# Altium schematic sheet STM32F4_OSD_V13.SchDoc
size 292 x 228 mm
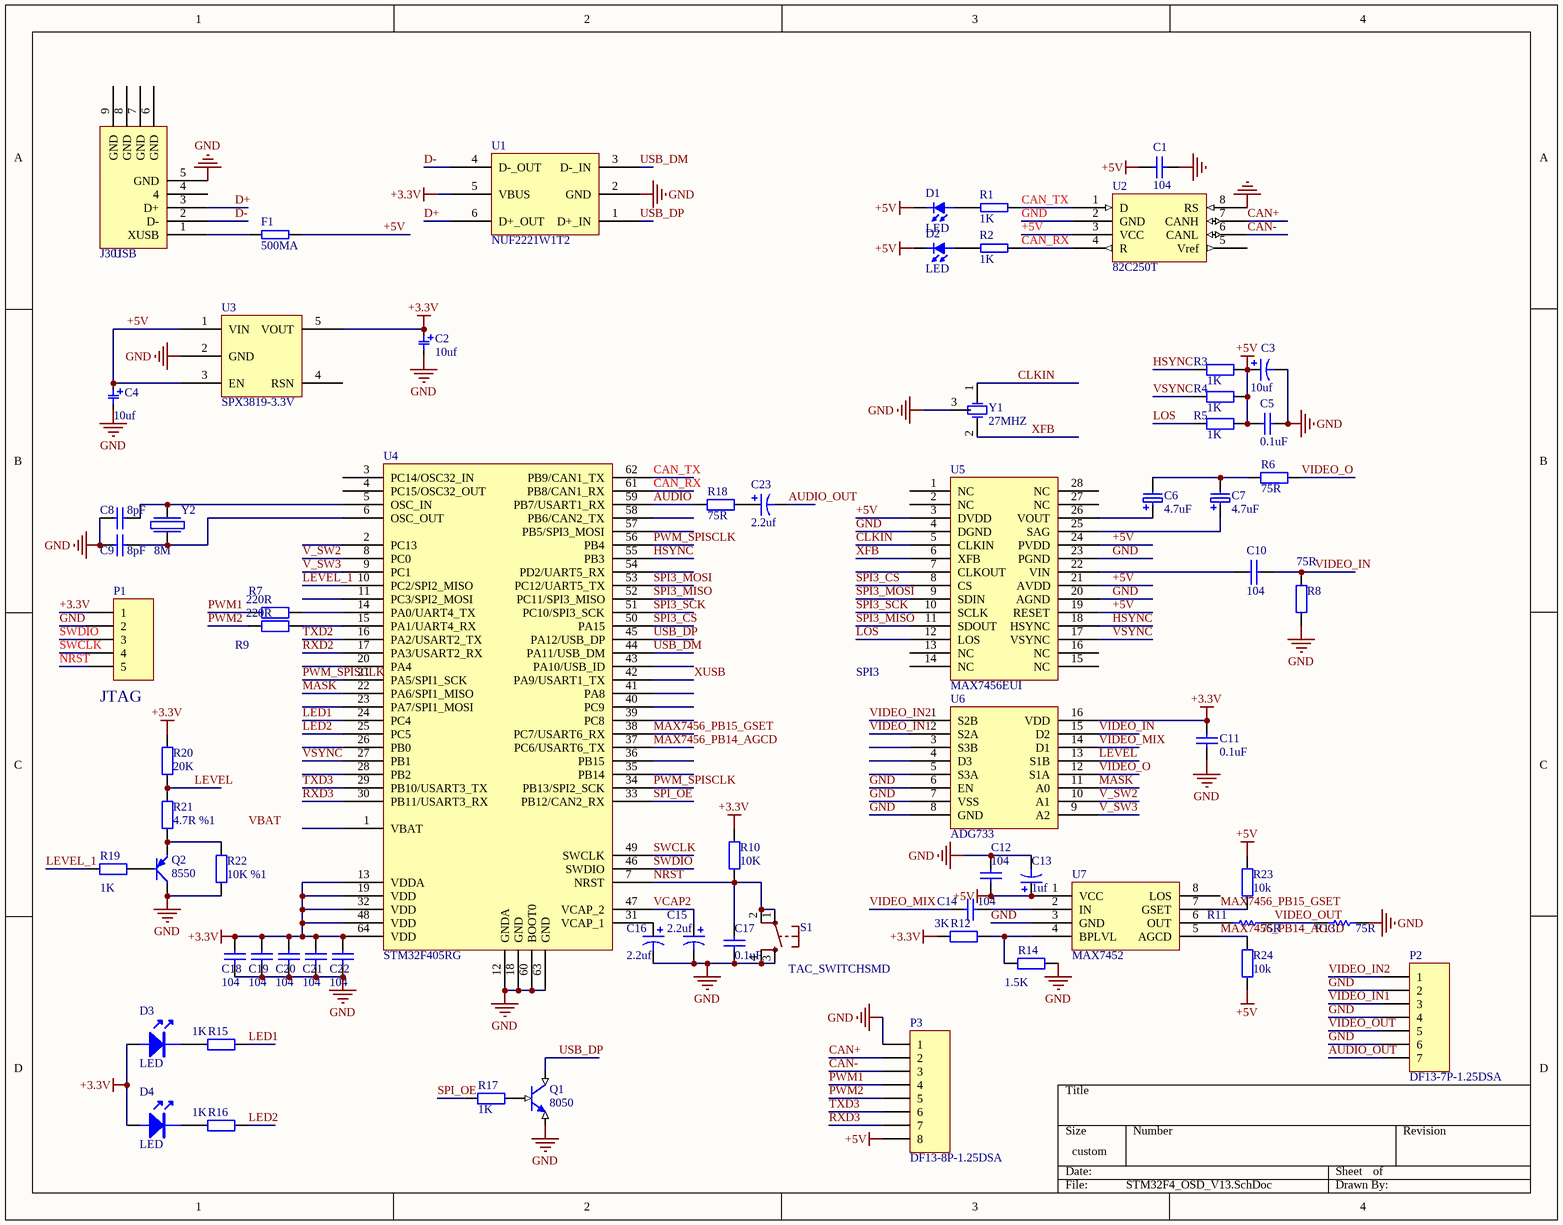
[diagram p0: STM32F4_OSD_V13.SchDoc]

## Parts
C1  104  [0603C]
C2  10uf  [0805]
C3  10uf  [0603C]
C4  10uf  [0805]
C5  value 0.1uF  [0402-CAP]  (hidden comment: Cap)
C6  4.7uF  [0603C]
C7  4.7uF  [0603C]
C8  8pF  [0402-CAP]
C9  8pF  [0402-CAP]
C10  104  [0402-CAP]
C11  value 0.1uF  [0402-CAP]  (hidden comment: Cap)
C12  104  [0402-CAP]
C13  1uf  [0603C]
C14  104  [0402-CAP]
C15  2.2uf  [0603C]
C16  2.2uf  [0603C]
C17  value 0.1uF  [0402-CAP]  (hidden comment: Cap)
C18  104  [0402-CAP]
C19  104  [0402-CAP]
C20  104  [0402-CAP]
C21  104  [0402-CAP]
C22  104  [0402-CAP]
C23  2.2uf  [0603C]
D1  LED  [0603-LED]
D2  LED  [0603-LED]
D3  LED  [0603-LED]
D4  LED  [0603-LED]
F1  500MA  [PTC-1206]
J301  USB  [MOLEX_MICRO_USB_AB_BOTTOM_MOUNT]
P1  JTAG  [DF13-5P-1.25DSA]
P2  DF13-7P-1.25DSA  [DF13C-7P-1.25V]
P3  DF13-8P-1.25DSA  [DF13C-8P-1.25V]
Q1  8050  [SOT-23]
Q2  8550  [PNP8550]
R1  1K  [0402-RES]
R2  1K  [0402-RES]
R3  1K  [0402-RES]
R4  1K  [0402-RES]
R5  1K  [0402-RES]
R6  75R  [0402-RES]
R7  220R  [0402-RES]
R8  75R  [0402-RES]
R9  220R  [0402-RES]
R10  10K  [0402-RES]
R11  75R  [0402-RES]
R12  3K  [0402-RES]
R13  75R  [0402-RES]
R14  1.5K  [0402-RES]
R15  1K  [0402-RES]
R16  1K  [0402-RES]
R17  1K  [0402-RES]
R18  75R  [0402-RES]
R19  1K  [0402-RES]
R20  20K  [0402-RES]
R21  4.7R %1  [0402-RES]
R22  10K %1  [0402-RES]
R23  10k  [0402-RES]
R24  10k  [0402-RES]
S1  TAC_SWITCHSMD  [EVQP7J01K]
U1  NUF2221W1T2  [SOT363]
U2  82C250T  [SO-8N]
U3  SPX3819-3.3V  [SOT23-5]
U4  STM32F405RG  [LQFP64]
U5  MAX7456EUI  [SSOP-28]
U6  ADG733  [TSOP16]
U7  MAX7452  [SOIC-SN8_N]
Y1  27MHZ  [27MHZ]
Y2  8M  [OSCILLATOR-3.2X2.5]

## Nets
+3.3V: C2.2 C11.2 C18.2 C19.2 C20.2 C21.2 C22.2 D3.1 D4.1 P1.1 R10.2 R12.2 R20.1 U1.5(VBUS) U3.5(VOUT) U4.13(VDDA) U4.19(VDD) U4.32(VDD) U4.48(VDD) U4.64(VDD) U6.16(VDD)
+5V: C1.2 C3.1 C4.2 C5.1 C12.1 C13.1 D1.2 D2.2 F1.1 P3.8 R3.2 R4.2 R5.2 R23.1 R24.2 U2.3(VCC) U3.1(VIN) U3.3(EN) U5.3(DVDD) U5.19(RESET) U5.21(AVDD) U5.24(PVDD) U7.1(VCC)
GND: C1.1 C2.1 C3.2 C4.1 C5.2 C8.2 C9.2 C11.1 C12.2 C13.2 C15.2 C16.2 C17.1 C18.1 C19.1 C20.1 C21.1 C22.1 J301.5(GND) P1.2 P2.2 P2.4 P2.6 P3.1 Q1.2(E) Q2.3(C) R8.1 R13.1 R14.1 R22.2 S1.3 S1.4 U1.2(GND) U2.2(GND) U2.8(RS) U3.2(GND) U4.12(GNDA) U4.18(GND) U4.60(BOOT0) U4.63(GND) U5.4(DGND) U5.20(AGND) U5.23(PGND) U6.6(EN) U6.7(VSS) U6.8(GND) U7.3(GND) Y1.3
AUDIO: R18.2 U4.59(PB7/USART1_RX)
AUDIO_OUT: C23.2 P2.7
CAN+: P3.2 U2.7(CANH)
CAN-: P3.3 U2.6(CANL)
CAN_RX: R2.2 U2.4(R) U4.61(PB8/CAN1_RX)
CAN_TX: R1.2 U2.1(D) U4.62(PB9/CAN1_TX)
CLKIN: U5.5(CLKIN) Y1.1
D+: J301.3(D+) U1.6(D+_OUT)
D-: J301.2(D-) U1.4(D-_OUT)
HSYNC: R3.1 U4.55(PB3) U5.18(HSYNC)
LED1: R15.1 U4.24(PC4)
LED2: R16.1 U4.25(PC5)
LEVEL: R20.2 R21.1 U6.13(S1B)
LEVEL_1: R19.2 U4.10(PC2/SPI2_MISO)
LOS: R5.1 U5.12(LOS)
MASK: U4.22(PA6/SPI1_MISO) U6.11(A0)
MAX7456_PB14_AGCD: R24.1 U4.37(PC6/USART6_TX) U7.5(AGCD)
MAX7456_PB15_GSET: R23.2 U4.38(PC7/USART6_RX) U7.7(GSET)
NRST: C17.2 P1.5 R10.1 S1.1 S1.2 U4.7(NRST)
PWM1: P3.4 R7.2
PWM2: P3.5 R9.2
PWM_SPISCLK: U4.21(PA5/SPI1_SCK) U4.34(PB13/SPI2_SCK) U4.56(PB4)
RXD2: U4.17(PA3/USART2_RX)
RXD3: P3.7 U4.30(PB11/USART3_RX)
SPI3_CS: U4.50(PA15) U5.8(CS)
SPI3_MISO: U4.52(PC11/SPI3_MISO) U5.11(SDOUT)
SPI3_MOSI: U4.53(PC12/UART5_TX) U5.9(SDIN)
SPI3_SCK: U4.51(PC10/SPI3_SCK) U5.10(SCLK)
SPI_OE: R17.1 U4.33(PB12/CAN2_RX)
SWCLK: P1.4 U4.49(SWCLK)
SWDIO: P1.3 U4.46(SWDIO)
TXD2: U4.16(PA2/USART2_TX)
TXD3: P3.6 U4.29(PB10/USART3_TX)
USB_DM: U1.3(D-_IN) U4.44(PA11/USB_DM)
USB_DP: Q1.3(C) U1.1(D+_IN) U4.45(PA12/USB_DP)
V_SW2: U4.8(PC0) U6.10(A1)
V_SW3: U4.9(PC1) U6.9(A2)
VCAP2: C15.1 U4.47(VCAP_2)
VIDEO_IN: C10.2 R8.2 U6.15(D2)
VIDEO_IN1: P2.3 U6.2(S2A)
VIDEO_IN2: P2.1 U6.1(S2B)
VIDEO_MIX: C14.1 U6.14(D1)
VIDEO_O: R6.2 U6.12(S1A)
VIDEO_OUT: P2.5 R11.1 R13.2
VSYNC: R4.1 U4.27(PB1) U5.17(VSYNC)
XFB: U5.6(XFB) Y1.2
XUSB: U4.42(PA9/USART1_TX)
NetC6_1: C6.1 U5.26(VOUT)
NetC6_2: C6.2 C7.2 R6.1
NetC7_1: C7.1 U5.25(SAG)
NetC8_1: C8.1 U4.5(OSC_IN) Y2.1
NetC9_1: C9.1 U4.6(OSC_OUT) Y2.2
NetC10_1: C10.1 U5.22(VIN)
NetC14_2: C14.2 U7.2(IN)
NetC16_1: C16.1 U4.31(VCAP_1)
NetC23_1: C23.1 R18.1
NetD1_1: D1.1 R1.1
NetD2_1: D2.1 R2.1
NetD3_2: D3.2 R15.2
NetD4_2: D4.2 R16.2
NetF1_2: F1.2 J301.1(XUSB)
NetQ1_1: Q1.1(B) R17.2
NetQ2_1: Q2.1(E) R21.2 R22.1
NetQ2_2: Q2.2(B) R19.1
NetR7_1: R7.1 U4.14(PA0/UART4_TX)
NetR9_1: R9.1 U4.15(PA1/UART4_RX)
NetR11_2: R11.2 U7.6(OUT)
NetR12_1: R12.1 R14.2 U7.4(BPLVL)

Not connected (* = marked no-connect by the designer): J301 4 6(GND) 7(GND) 8(GND) 9(GND); U2 5(Vref); U3 4(RSN); U4 1(VBAT) 2(PC13) 3(PC14/OSC32_IN) 4(PC15/OSC32_OUT) 11(PC3/SPI2_MOSI) 20(PA4) 23(PA7/SPI1_MOSI) 26(PB0) 28(PB2) 35(PB14) 36(PB15) 39(PC8) 40(PC9) 41(PA8) 43(PA10/USB_ID) 54(PD2/UART5_RX) 57(PB5/SPI3_MOSI) 58(PB6/CAN2_TX); U5 1(NC) 2(NC) 7(CLKOUT) 13(NC) 14(NC) 15(NC) 16(NC) 27(NC) 28(NC); U6 3(S3B) 4(D3) 5(S3A); U7 8(LOS)

## Notes on the sheet
- SPI3
- Labels drawn without touching a wire or pin: VBAT

## Library data of the parts
C1 = CAP: Capacitor; Value: 100nF; Published: 8-Jun-2000; Revision: July-2002: Re-released for DXP Platform.; Publisher: Altium Limited
C2 C4 = E
C3 C13 C15 C16 C23 = Cap Pol1: Polarized Capacitor (Radial)
C5 C11 C12 C14 C17-C22 = Cap: Capacitor
  C5 C11 C17: Published: 8-Jun-2000; LatestRevisionDate: 17-Jul-2002; LatestRevisionNote: Re-released for DXP Platform.; PackageReference: RAD-0.3; Publisher: Altium Limited; PackageDescription: Radial Cap, Thru-Hole; 2 Leads; 0.3 in Pin Spacing
C6 C7 = ELECTRO1: Electrolytic Capacitor 1
C8 C9 = CAP0805: Capacitor
C10 = CAP: Capacitor
F1 R1 R2 = RES
P1 = Header 5: Header, 5-Pin
P2 = Header 7: Header, 7-Pin
P3 = Header 8: Header, 8-Pin
Q2 = PNPA: PNP Transistor
R3-R10 R12 R14-R24 = Res2: Resistor
R11 R13 = Res1: Resistor
U2 = SN65HVD230D
U3 = SP6
U5 = MAX7456
Y1 = 晶振3脚
Y2 = ZQ_KX12B: 7B-8.000MAAJ-T